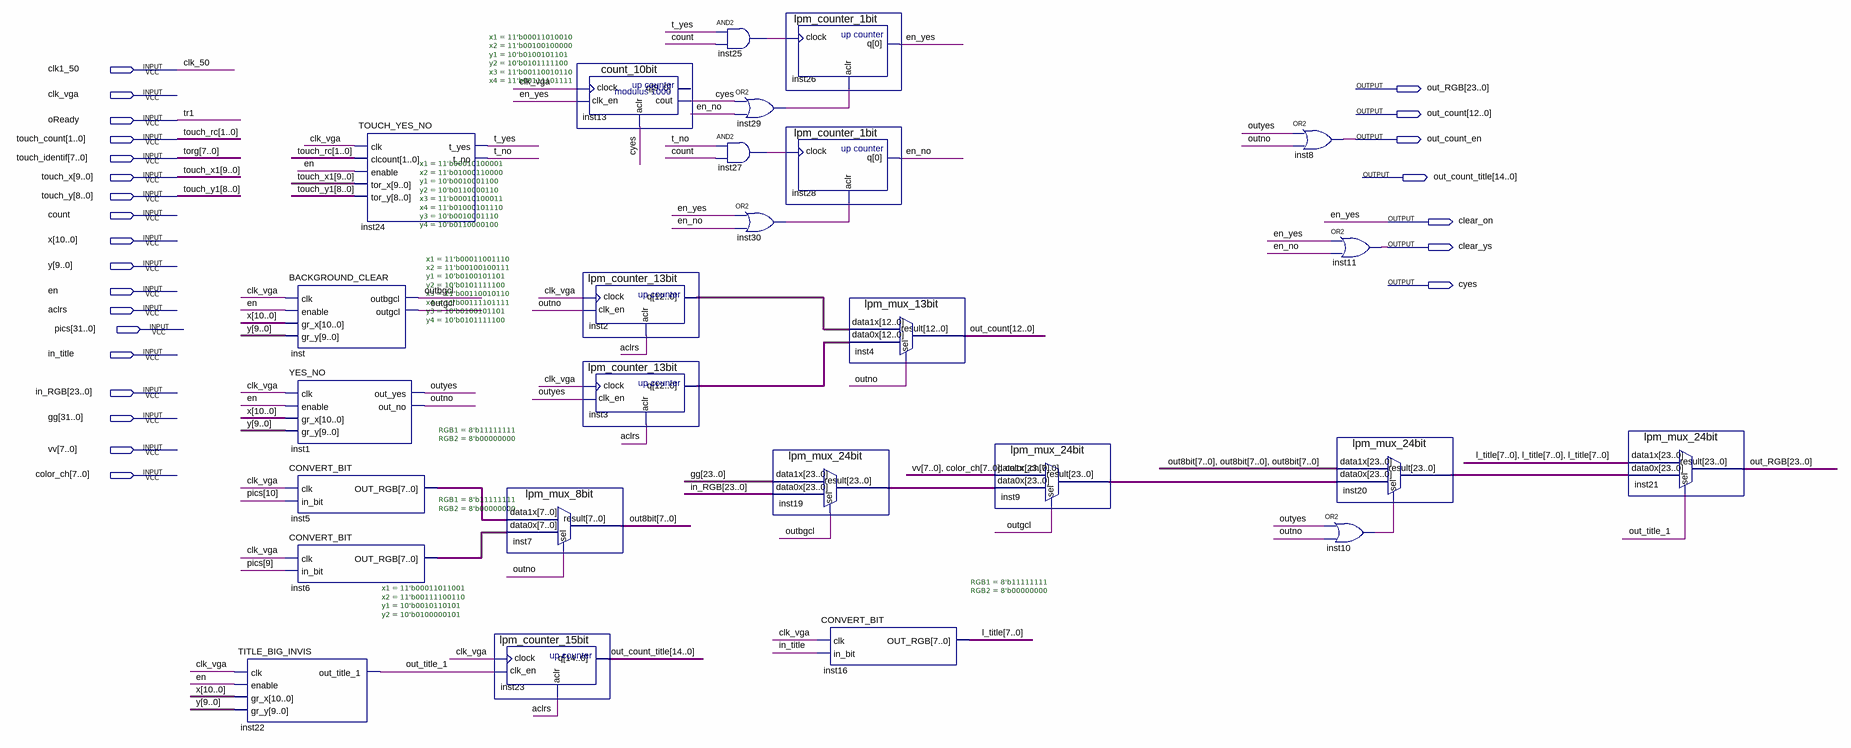
[diagram p0: schematic sheet]
// Quartus schematic CLEAR.bdf as structural Verilog: 26 symbols, 25 pins
module CLEAR (
  input  clk1_50,
  input  clk_vga,
  input  oReady,
  input  [1:0] touch_count,
  input  [7:0] touch_identif,
  input  [9:0] touch_x,
  input  [8:0] touch_y,
  input  count,
  input  [10:0] x,
  input  [9:0] y,
  input  en,
  input  aclrs,
  input  [31:0] pics,
  input  in_title,
  input  [23:0] in_RGB,
  input  [31:0] gg,
  input  [7:0] vv,
  input  [7:0] color_ch,
  output [23:0] out_RGB,
  output [12:0] out_count,
  output out_count_en,
  output [14:0] out_count_title,
  output clear_on,
  output clear_ys,
  output cyes
);

  wire en_no, inst10_out, inst25_out, inst27_out, inst29_out, inst30_out, out_title_1, outbgcl, outgcl,
       outno, outyes, t_no, t_yes;
  wire [7:0] inst5_out_rgb, inst6_out_rgb, l_title, out8bit;
  wire [12:0] inst2_q, inst3_q;
  wire [23:0] inst9_result, inst19_result, inst20_result;

  TITLE_BIG_INVIS #(.x1(11'b00011011001), .x2(11'b00111100110), .y1(10'b0010110101), .y2(10'b0100000101)) inst22 (
    .clk(clk_vga), .enable(en), .gr_x(x), .gr_y(y), .out_title_1(out_title_1));
  BACKGROUND_CLEAR #(.x1(11'b00010100001), .x2(11'b01000110000), .y1(10'b0010001100), .y2(10'b0110000110), .x3(11'b00010100011), .x4(11'b01000101110), .y3(10'b0010001110), .y4(10'b0110000100)) inst (
    .clk(clk_vga), .enable(en), .gr_x(x), .gr_y(y), .outbgcl(outbgcl), .outgcl(outgcl));
  YES_NO #(.x1(11'b00011001110), .x2(11'b00100100111), .y1(10'b0100101101), .y2(10'b0101111100), .x3(11'b00110010110), .x4(11'b00111101111), .y3(10'b0100101101), .y4(10'b0101111100)) inst1 (
    .clk(clk_vga), .enable(en), .gr_x(x), .gr_y(y), .out_yes(outyes), .out_no(outno));
  CONVERT_BIT #(.RGB1(8'b11111111), .RGB2(8'b00000000)) inst5 (
    .clk(clk_vga), .in_bit(pics[10]), .OUT_RGB(inst5_out_rgb));
  CONVERT_BIT #(.RGB1(8'b11111111), .RGB2(8'b00000000)) inst6 (
    .clk(clk_vga), .in_bit(pics[9]), .OUT_RGB(inst6_out_rgb));
  TOUCH_YES_NO #(.x1(11'b00011010010), .x2(11'b00100100000), .y1(10'b0100101101), .y2(10'b0101111100), .x3(11'b00110010110), .x4(11'b00111101111)) inst24 (
    .clk(clk_vga), .clcount(touch_count), .enable(en), .tor_x(touch_x), .tor_y(touch_y), .t_yes(t_yes),
    .t_no(t_no));
  lpm_counter_15bit inst23 (.clock(clk_vga), .clk_en(out_title_1), .aclr(aclrs), .q(out_count_title));
  lpm_mux_8bit inst7 (.data1x(inst5_out_rgb), .data0x(inst6_out_rgb), .sel(outno), .result(out8bit));
  count_10bit inst13 (.clock(clk_vga), .clk_en(clear_on), .aclr(cyes), .cout(cyes));  // open: q
  lpm_counter_13bit inst2 (.clock(clk_vga), .clk_en(outno), .aclr(aclrs), .q(inst2_q));
  lpm_counter_13bit inst3 (.clock(clk_vga), .clk_en(outyes), .aclr(aclrs), .q(inst3_q));
  and inst25 (inst25_out, t_yes, count);
  or inst29 (inst29_out, cyes, en_no);
  and inst27 (inst27_out, t_no, count);
  or inst30 (inst30_out, clear_on, en_no);
  lpm_counter_1bit inst26 (.clock(inst25_out), .aclr(inst29_out), .q(clear_on));
  lpm_counter_1bit inst28 (.clock(inst27_out), .aclr(inst30_out), .q(en_no));
  lpm_mux_24bit inst19 (.data1x(gg[23:0]), .data0x(in_RGB), .sel(outbgcl), .result(inst19_result));
  lpm_mux_13bit inst4 (.data1x(inst2_q), .data0x(inst3_q), .sel(outno), .result(out_count));
  CONVERT_BIT #(.RGB1(8'b11111111), .RGB2(8'b00000000)) inst16 (.clk(clk_vga), .in_bit(in_title), .OUT_RGB(l_title));
  lpm_mux_24bit inst9 (.data1x({vv, color_ch, color_ch}), .data0x(inst19_result), .sel(outgcl), .result(inst9_result));
  or inst8 (out_count_en, outyes, outno);
  or inst11 (clear_ys, clear_on, en_no);
  lpm_mux_24bit inst20 (
    .data1x({out8bit, out8bit, out8bit}), .data0x(inst9_result), .sel(inst10_out), .result(inst20_result));
  or inst10 (inst10_out, outyes, outno);
  lpm_mux_24bit inst21 (
    .data1x({l_title, l_title, l_title}), .data0x(inst20_result), .sel(out_title_1), .result(out_RGB));

  // Other names for the same wires on the sheet: clk_50 = clk1_50; en_yes = clear_on; torg[7:0] = touch_identif;
  //   touch_rc[1:0] = touch_count; touch_x1[9:0] = touch_x; touch_y1[8:0] = touch_y; tr1 = oReady
endmodule
